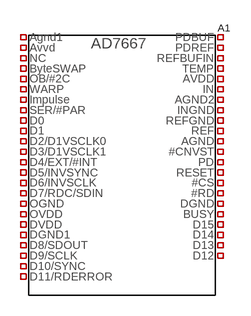
[diagram p0: schematic CCD circuit 1 feb25.asc]
CCD circuit 1 feb25.asc, the LTspice schematic file:
Version 4
SHEET 1 880 680
SYMBOL AD7667 -928 48 R0
SYMATTR SpiceModel ""
SYMATTR InstName A1

The netlist it stands for:
* CCD circuit 1 feb25.asc
A1 0 0 0 0 0 0 0 0 AD7667
.backanno
.end